# EasyEDA schematic easyeda-caudalimetro.json
TITLE: Caudalímetro; REV: 1.0; Date: 2022-02-08; Sheet: 1/1; Drawn By: Carlos Flores; Company: Carlos Flores
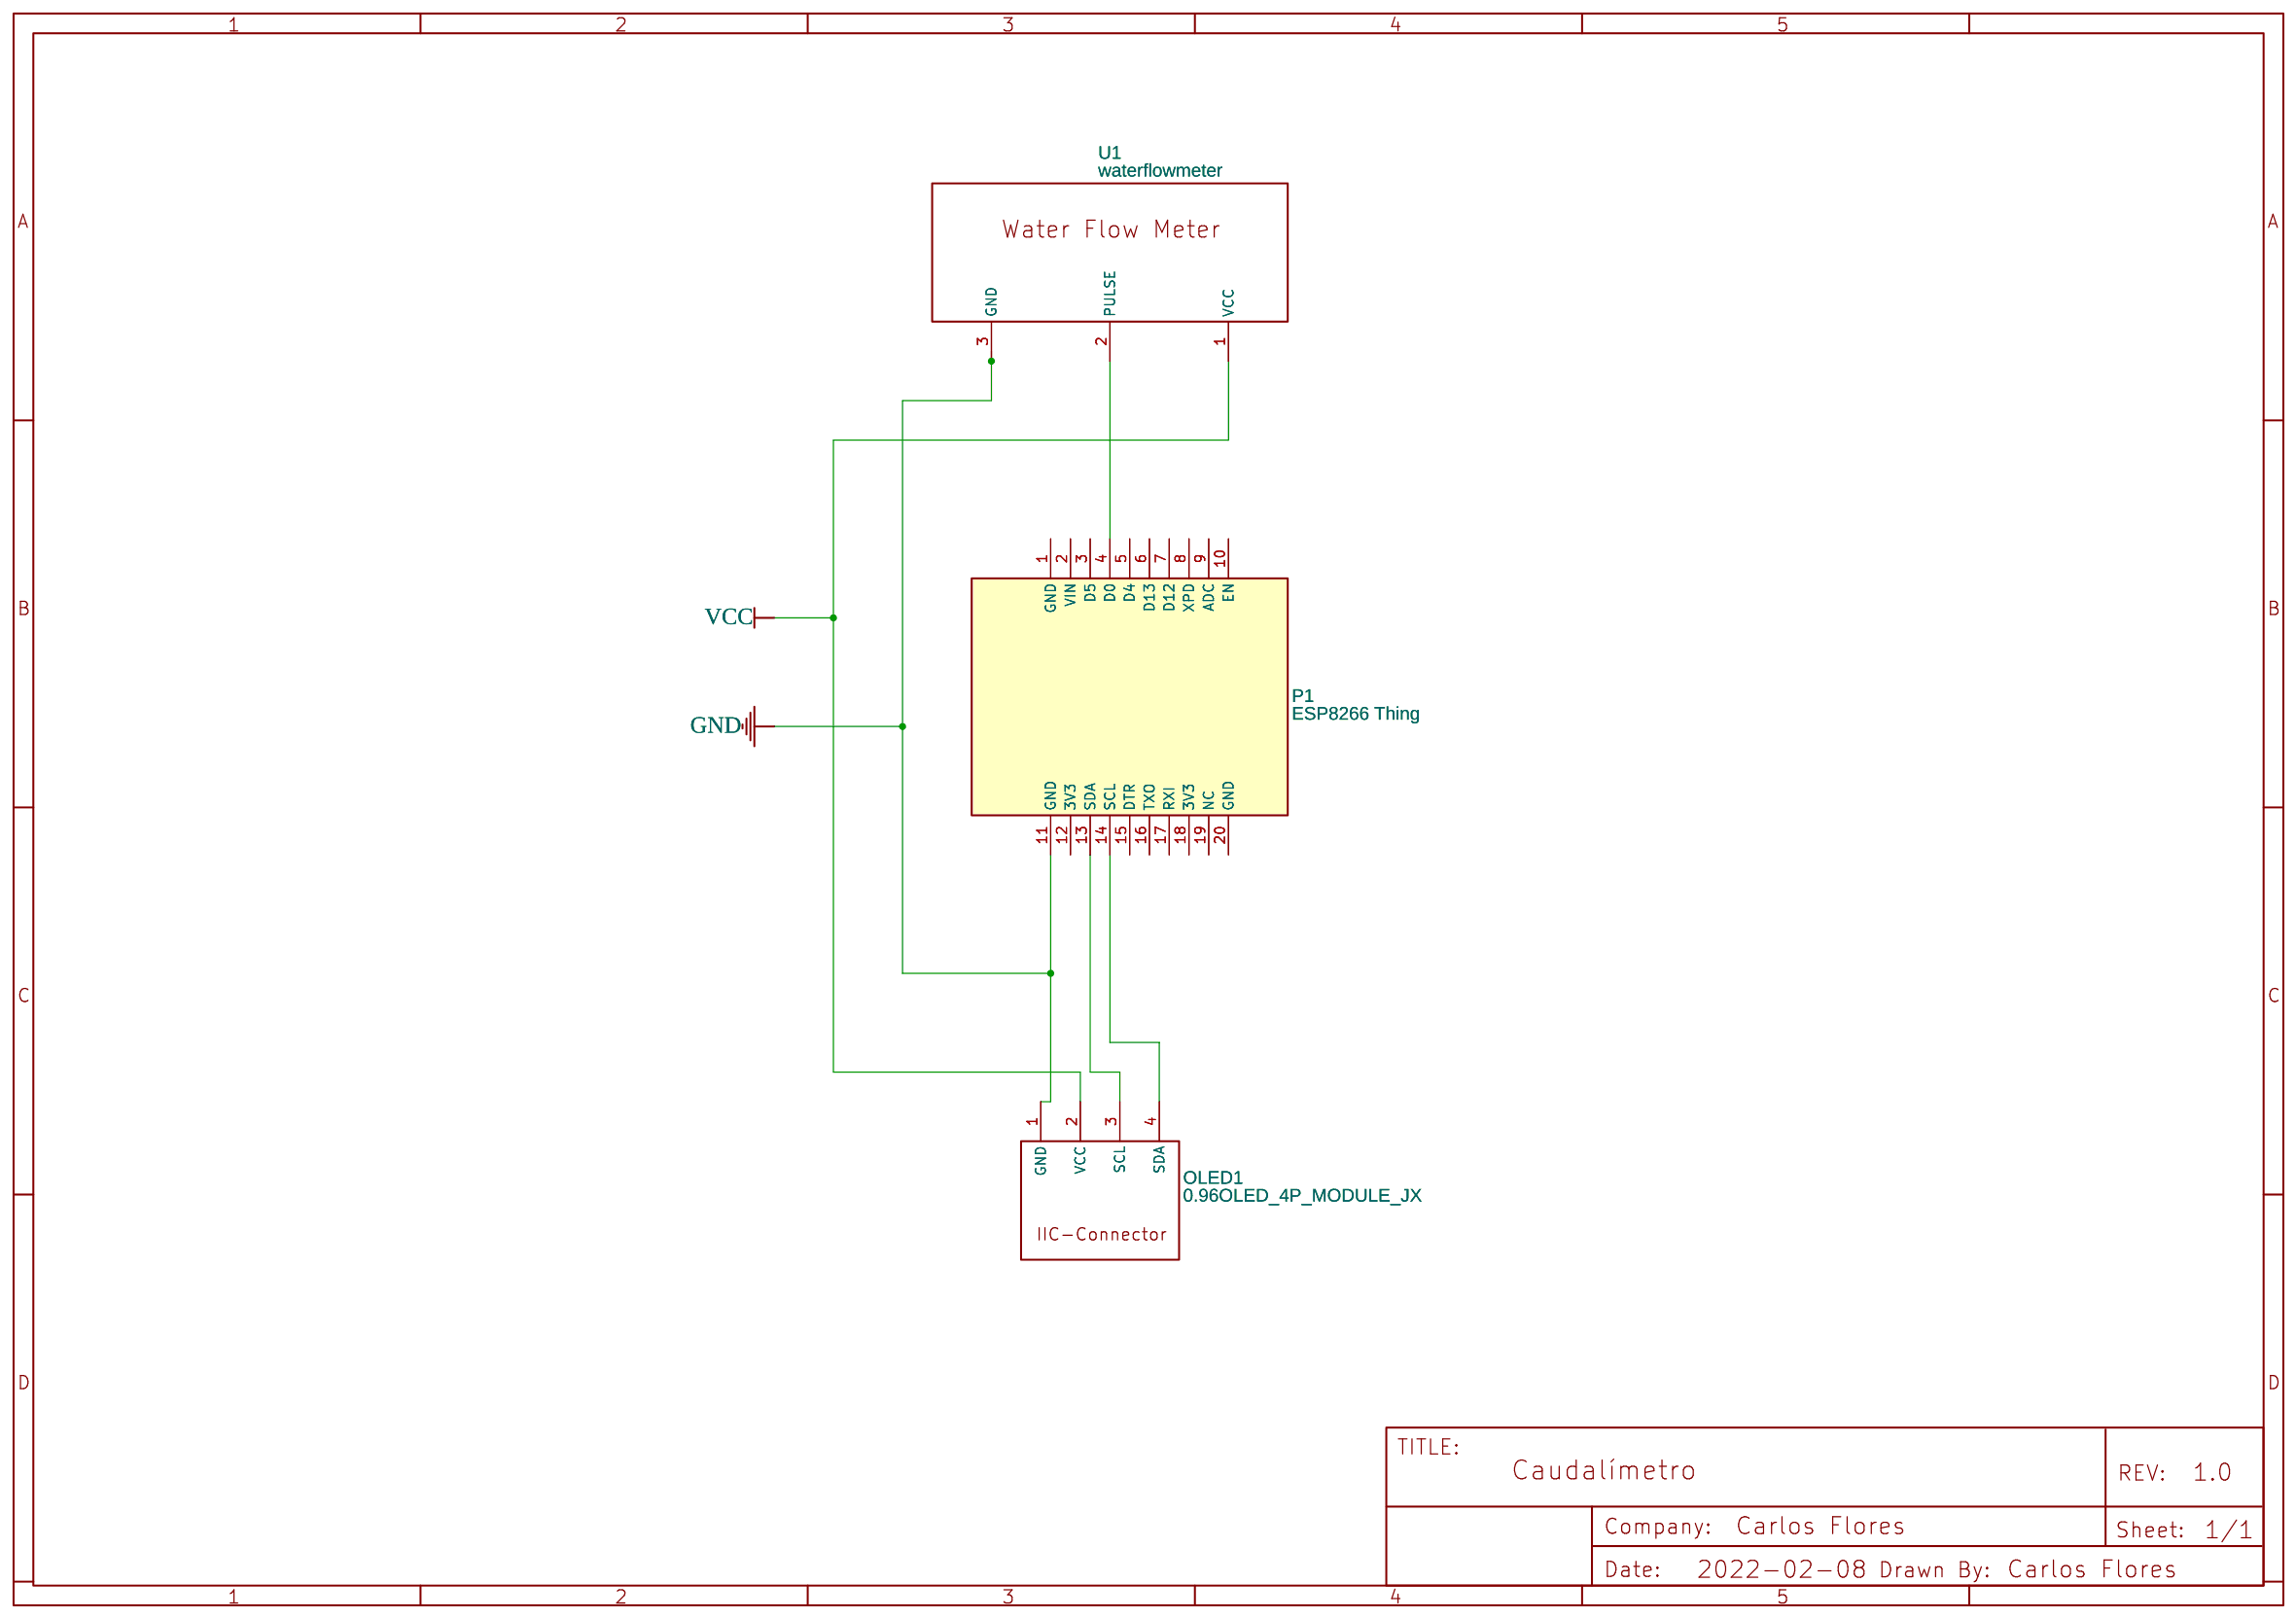
[diagram p0: schematic sheet]

## Parts
OLED1  0.96OLED_4P_MODULE_JX  [0.96OLED_4P]
P1  ESP8266 Thing  [ESP8266 THING]
U1  waterflowmeter

## Library data of the parts
OLED1 = 0.96OLED_4P_MODULE_JX: Supplier: LCSC; Supplier Part: C9900004566; Manufacturer: null; Contributor: LCSC; JLCPCB Part Class: Extended Part
P1 = ESP8266 Thing: sourceId: 1T5FDZYC8
U1 = waterflowmeter: Manufacturer Part: all; Contributor: Ferdinand Thomas

## Nets
GND: OLED1.1(GND) P1.11(GND) U1.3(GND)
VCC: OLED1.2(VCC) U1.1(VCC)
Net-(OLED1-3): OLED1.3(SCL) P1.13(SDA)
Net-(OLED1-4): OLED1.4(SDA) P1.14(SCL)
Net-(P1-4): P1.4(D0) U1.2(PULSE)

Not connected (* = marked no-connect by the designer): P1 1(GND) 2(VIN) 3(D5) 5(D4) 6(D13) 7(D12) 8(XPD) 9(ADC) 10(EN) 12(3V3) 15(DTR) 16(TXO) 17(RXI) 18(3V3) 19(NC) 20(GND)
